# EAGLE schematic schematic (EAGLE 8.6.3)
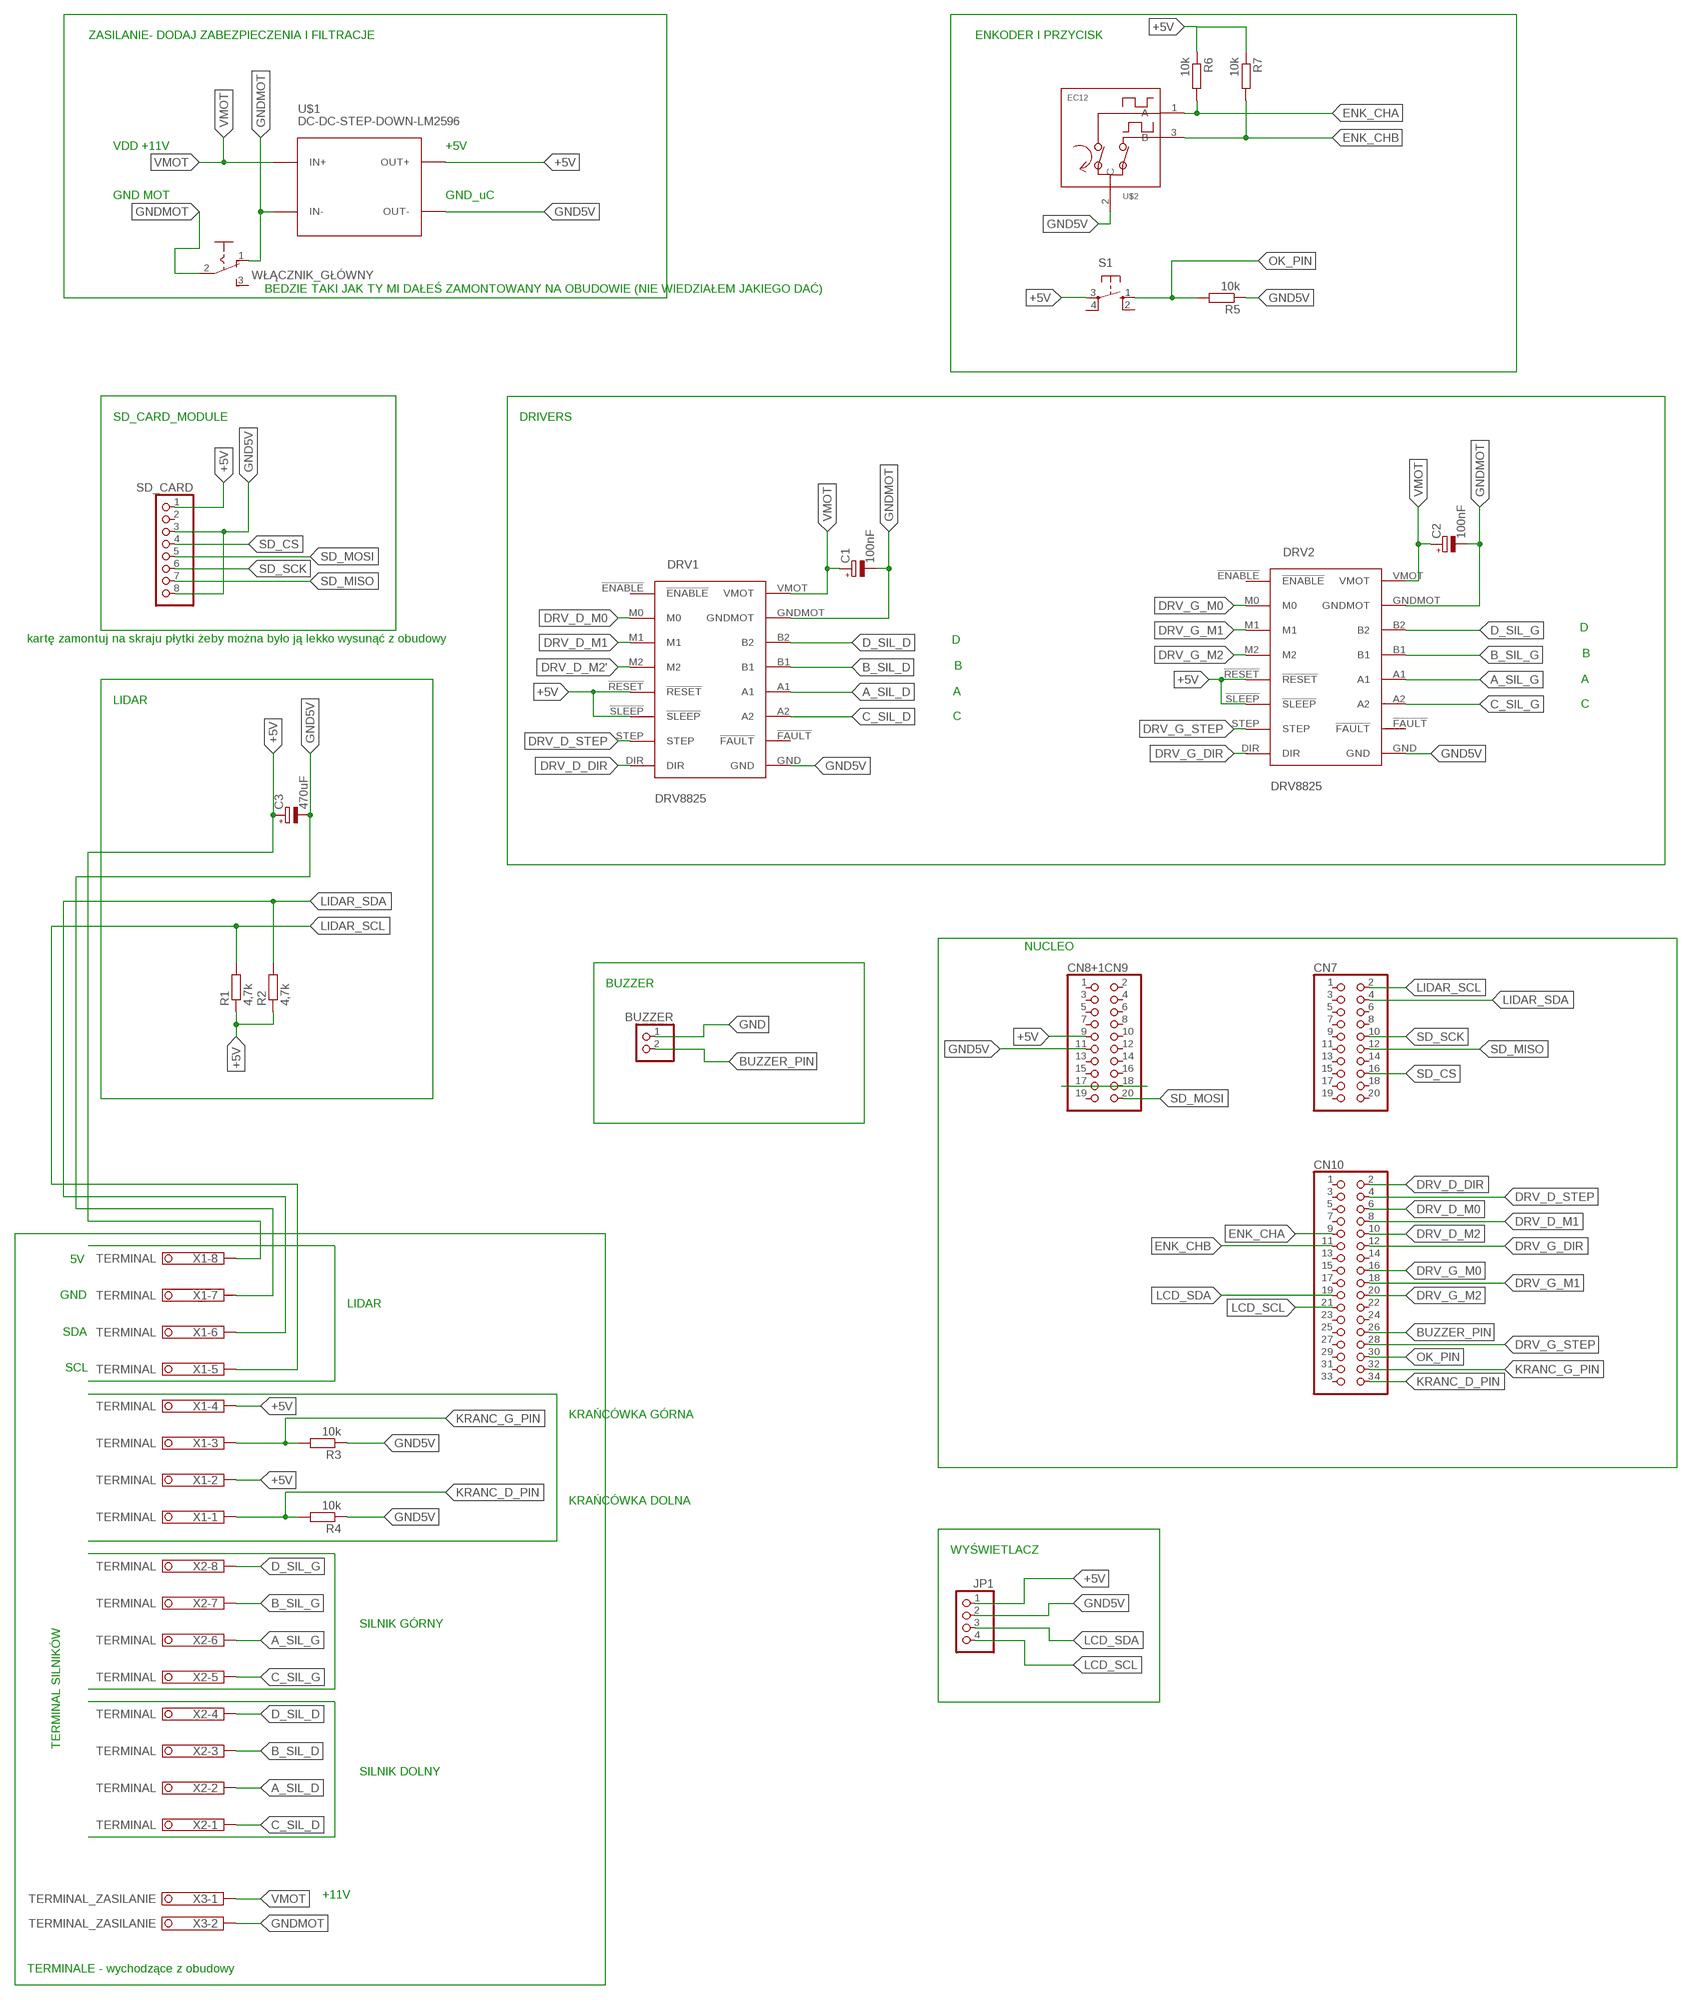
[diagram p0: schematic, sheet 1]

## Parts
BUZZER  PINHD-1X2  [1X02]
C1  100nF  CPOL-EUE2.5-7  [E2,5-7]
C2  100nF  CPOL-EUE2.5-7  [E2,5-7]
C3  470uF  CPOL-EUE2.5-7  [E2,5-7]
CN7  PINHD-2X10  [2X10]
CN8+1CN9  PINHD-2X10  [2X10]
CN10  PINHD-2X17  [2X17]
DRV1  DRV8825  [DRV8825]
DRV2  DRV8825  [DRV8825]
JP1  PINHD-1X4  [1X04]
R1  4,7k  R-EU_0207/10  [0207/10]
R2  4,7k  R-EU_0207/10  [0207/10]
R3  10k  R-EU_0207/10  [0207/10]
R4  10k  R-EU_0207/10  [0207/10]
R5  10k  R-EU_0207/10  [0207/10]
R6  10k  R-EU_0207/10  [0207/10]
R7  10k  R-EU_0207/10  [0207/10]
S1  10-XX  [B3F-10XX]
SD_CARD  PINHD-1X8  [1X08]
U$1  DC-DC-STEP-DOWN-LM2596  [DC-DC-STEP-DOWN-LM2596]
U$2  EC12  [EC12]
WŁĄCZNIK_GŁÓWNY  255SB  [255SB]
X1  TERMINAL  TERMINAL-BLOCK-3.5MM-8-PIN-ROUND-PAD  [TERMINAL-BLOCK-8-PIN-3.5MM-ROUND-PAD]
X2  TERMINAL  TERMINAL-BLOCK-3.5MM-8-PIN-ROUND-PAD  [TERMINAL-BLOCK-8-PIN-3.5MM-ROUND-PAD]
X3  TERMINAL_ZASILANIE  TERMINAL-BLOCK-3.5MM-2-PIN-ROUND-PAD  [TERMINAL-BLOCK-2-PIN-3.5MM-ROUND-PAD]

## Nets
+5V: C3.+ CN8+1CN9.9 DRV1.!RESET DRV1.!SLEEP DRV2.!RESET DRV2.!SLEEP JP1.1 R1.1 R2.1 S1.3(P) SD_CARD.1 U$1.OUT+ X1.2 X1.4 X1.8
A_SIL_D: DRV1.A1 X2.2
A_SIL_G: DRV2.A1 X2.6
B_SIL_D: DRV1.B1 X2.3
B_SIL_G: DRV2.B1 X2.7
BUZZER_PIN: BUZZER.2 CN10.26
C_SIL_D: DRV1.A2 X2.1
C_SIL_G: DRV2.A2 X2.5
D_SIL_D: DRV1.B2 X2.4
D_SIL_G: DRV2.B2 X2.8
DRV_D_DIR: CN10.2 DRV1.DIR
DRV_D_M0: CN10.6 DRV1.M0
DRV_D_M1: CN10.8 DRV1.M1
DRV_D_M2: CN10.10
DRV_D_M2': DRV1.M2
DRV_D_STEP: CN10.4 DRV1.STEP
DRV_G_DIR: CN10.12 DRV2.DIR
DRV_G_M0: CN10.16 DRV2.M0
DRV_G_M1: CN10.18 DRV2.M1
DRV_G_M2: CN10.20 DRV2.M2
DRV_G_STEP: CN10.28 DRV2.STEP
ENK_CHA: CN10.9 R6.2 U$2.1(A)
ENK_CHB: CN10.11 R7.2 U$2.3(B)
GND: BUZZER.1
GND5V: C3.- CN8+1CN9.11 DRV1.GND DRV2.GND JP1.2 R3.1 R4.1 R5.1 SD_CARD.3 SD_CARD.8 U$1.OUT- X1.7
GNDMOT: C1.- C2.- DRV1.GNDMOT DRV2.GNDMOT U$1.IN- WŁĄCZNIK_GŁÓWNY.1(O) WŁĄCZNIK_GŁÓWNY.2(P) X3.2
KRANC_D_PIN: CN10.34 R4.2 X1.1
KRANC_G_PIN: CN10.32 R3.2 X1.3
LCD_SCL: CN10.21 JP1.4
LCD_SDA: CN10.19 JP1.3
LIDAR_SCL: CN7.2 R1.2 X1.5
LIDAR_SDA: CN7.4 R2.2 X1.6
N$15: U$2.2(C)
N$18: R6.1 R7.1
OK_PIN: CN10.30 S1.1(S)
SD_CS: CN7.16 SD_CARD.4
SD_MISO: CN7.12 SD_CARD.7
SD_MOSI: CN8+1CN9.20 SD_CARD.5
SD_SCK: CN7.10 SD_CARD.6
VMOT: C1.+ C2.+ DRV1.VMOT DRV2.VMOT U$1.IN+ X3.1
Unconnected: CN7.1 CN7.3 CN7.5 CN7.6 CN7.7 CN7.8 CN7.9 CN7.11 CN7.13 CN7.14 CN7.15 CN7.17 CN7.18 CN7.19 CN7.20 CN8+1CN9.1 CN8+1CN9.2 CN8+1CN9.3 CN8+1CN9.4 CN8+1CN9.5 CN8+1CN9.6 CN8+1CN9.7 CN8+1CN9.8 CN8+1CN9.10 CN8+1CN9.12 CN8+1CN9.13 CN8+1CN9.14 CN8+1CN9.15 CN8+1CN9.16 CN8+1CN9.17 CN8+1CN9.18 CN8+1CN9.19 CN10.1 CN10.3 CN10.5 CN10.7 CN10.13 CN10.14 CN10.15 CN10.17 CN10.22 CN10.23 CN10.24 CN10.25 CN10.27 CN10.29 CN10.31 CN10.33 DRV1.!ENABLE DRV1.!FAULT DRV2.!ENABLE DRV2.!FAULT R5.2 S1.2(S1) S1.4(P1) SD_CARD.2 WŁĄCZNIK_GŁÓWNY.3(S)

## Notes on the sheet
- ZASILANIE- DODAJ ZABEZPIECZENIA I FILTRACJE | ENKODER I PRZYCISK
- VDD +11V | +5V
- GND MOT | GND_uC
- BEDZIE TAKI JAK TY MI DAŁEŚ ZAMONTOWANY NA OBUDOWIE (NIE WIEDZIAŁEM JAKIEGO DAĆ)
- SD_CARD_MODULE | DRIVERS
- D
- kartę zamontuj na skraju płytki żeby można było ją lekko wysunąć z obudowy | D
- B
- B
- A
- A
- LIDAR
- C
- C
- NUCLEO
- BUZZER
- 5V
- GND
- LIDAR
- SDA
- SCL
- KRAŃCÓWKA GÓRNA
- KRAŃCÓWKA DOLNA
- WYŚWIETLACZ
- TERMINAL SILNIKÓW | SILNIK GÓRNY
- SILNIK DOLNY
- +11V
- TERMINALE - wychodzące z obudowy

## Library data of the parts
BUZZER = pinhead:PINHD-1X2: PIN HEADER
C1-C3 = rcl:CPOL-EU: POLARIZED CAPACITOR, European symbol; SPICEPREFIX: C
CN7 CN8+1CN9 = pinhead:PINHD-2X10: PIN HEADER
CN10 = pinhead:PINHD-2X17: PIN HEADER
DRV1 DRV2 = POLOLU_DRV8825:DRV8825
JP1 = pinhead:PINHD-1X4: PIN HEADER
R1-R7 = rcl:R-EU_: RESISTOR, European symbol; SPICEPREFIX: R
S1 = switch-omron:10-XX: OMRON SWITCH; MPN: B3F-1000; OC_FARNELL: 176432; OC_NEWARK: 36M3542
SD_CARD = pinhead:PINHD-1X8: PIN HEADER
U$1 = diy-modules:DC-DC-STEP-DOWN-LM2596: DC/DC Step-Down Regulator based on LM2596-ADJ chip LM2596 datasheet available here: http://www.ti.com/lit/ds/symlink/lm2596.pdf Click here to find device on ebay.com <http://www.ebay.com/sch/lm2596+power+regulator>
U$2 = rotary-encoder:EC12
WŁĄCZNIK_GŁÓWNY = switch:255SB: SLIDING SWITCH Distributor Buerklin, 11G810
X1 X2 = Rembrandt Electronics - Terminal Block 3-5mm v1-0:TERMINAL-BLOCK-3.5MM-8-PIN: Terminal Block 3.5mm Pitch: 3,5 mm Number of pins: 8 Created by Rembrandt Electronics www.rembrandtelectronics.com
X3 = Rembrandt Electronics - Terminal Block 3-5mm v1-0:TERMINAL-BLOCK-3.5MM-2-PIN: Terminal Block 3.5mm Pitch: 3,5 mm Number of pins: 2 Created by Rembrandt Electronics www.rembrandtelectronics.com